# EAGLE design Multicolor LED (EAGLE 5.04)
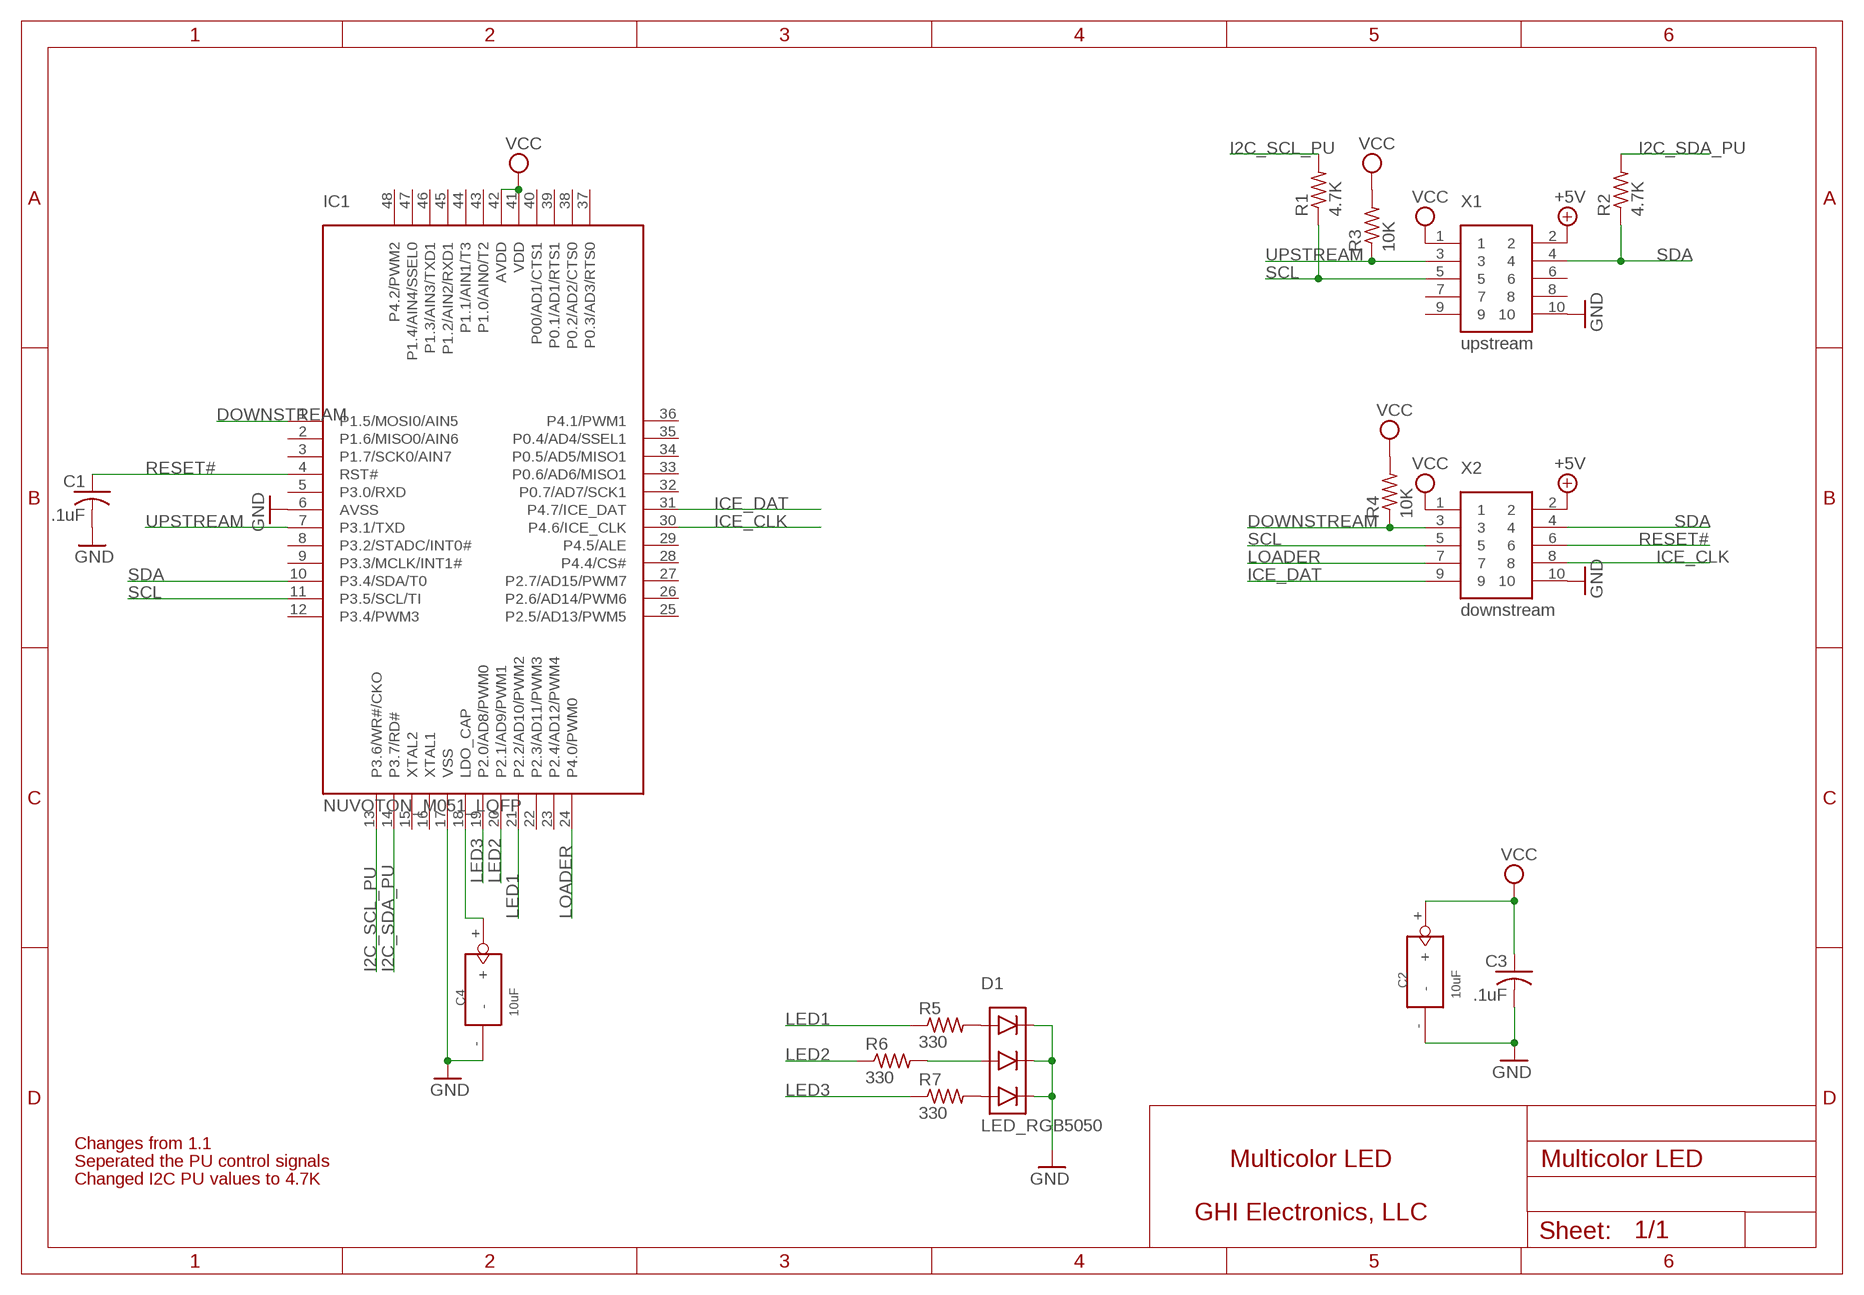
[diagram p0: schematic, sheet 1]

## Parts
C1  .1uF  C-USC0603K  [C0603K]
C2  10uF  C_TAN_3X3.5  [C_TAN_3X3.5]
C3  .1uF  C-USC0603K  [C0603K]
C4  10uF  C_TAN_3X3.5  [C_TAN_3X3.5]
D1  LED_RGB5050  [LED_RGB_5050]
IC1  NUVOTON_M051_LQFP  [LQFP48]
R1  4.7K  R-US_R0603  [R0603]
R2  4.7K  R-US_R0603  [R0603]
R3  10K  R-US_R0603  [R0603]
R4  10K  R-US_R0603  [R0603]
R5  330  R-US_R0603  [R0603]
R6  330  R-US_R0603  [R0603]
R7  330  R-US_R0603  [R0603]
X1  upstream  2X5_1.27MM  [2X5_1.27MM]
X2  downstream  2X5_1.27MM  [2X5_1.27MM]

## Nets
+5V [power]: X1.2 X2.2
DOWNSTREAM: IC1.1(P1.5/MOSI0/AIN5) R4.1 X2.3
GND [power]: C1.2 C2.- C3.2 C4.- D1.LED1K D1.LED2K D1.LED3K IC1.6(AVSS) IC1.17(VSS) X1.10 X2.10
I2C_SCL_PU: IC1.13(P3.6/WR#/CKO) R1.2
I2C_SDA_PU: IC1.14(P3.7/RD#) R2.2
ICE_CLK: IC1.30(P4.6/ICE_CLK) X2.8
ICE_DAT: IC1.31(P4.7/ICE_DAT) X2.9
LED1: IC1.21(P2.2/AD10/PWM2) R5.1
LED2: IC1.20(P2.1/AD9/PWM1) R6.1
LED3: IC1.19(P2.0/AD8/PWM0) R7.1
LOADER: IC1.24(P4.0/PWM0) X2.7
N$1: D1.LED1A R5.2
N$2: D1.LED2A R6.2
N$3: D1.LED3A R7.2
N$4: C4.+ IC1.18(LDO_CAP)
RESET#: C1.1 IC1.4(RST#) X2.6
SCL: IC1.11(P3.5/SCL/TI) R1.1 X1.5 X2.5
SDA: IC1.10(P3.4/SDA/T0) R2.1 X1.4 X2.4
UPSTREAM: IC1.7(P3.1/TXD) R3.1 X1.3
VCC [power]: C2.+ C3.1 IC1.41(VDD) IC1.42(AVDD) R3.2 R4.2 X1.1 X2.1
Unconnected: IC1.2(P1.6/MISO0/AIN6) IC1.3(P1.7/SCK0/AIN7) IC1.5(P3.0/RXD) IC1.8(P3.2/STADC/INT0#) IC1.9(P3.3/MCLK/INT1#) IC1.12(P3.4/PWM3) IC1.15(XTAL2) IC1.16(XTAL1) IC1.22(P2.3/AD11/PWM3) IC1.23(P2.4/AD12/PWM4) IC1.25(P2.5/AD13/PWM5) IC1.26(P2.6/AD14/PWM6) IC1.27(P2.7/AD15/PWM7) IC1.28(P4.4/CS#) IC1.29(P4.5/ALE) IC1.32(P0.7/AD7/SCK1) IC1.33(P0.6/AD6/MISO1) IC1.34(P0.5/AD5/MISO1) IC1.35(P0.4/AD4/SSEL1) IC1.36(P4.1/PWM1) IC1.37(P0.3/AD3/RTS0) IC1.38(P0.2/AD2/CTS0) IC1.39(P0.1/AD1/RTS1) IC1.40(P00/AD1/CTS1) IC1.43(P1.0/AIN0/T2) IC1.44(P1.1/AIN1/T3) IC1.45(P1.2/AIN2/RXD1) IC1.46(P1.3/AIN3/TXD1) IC1.47(P1.4/AIN4/SSEL0) IC1.48(P4.2/PWM2) X1.6 X1.7 X1.8 X1.9

## Notes on the sheet
- Changes from 1.1
- Seperated the PU control signals | Multicolor LED
- Changed I2C PU values to 4.7K
- GHI Electronics, LLC

## Library data of the parts
C1 C3 = rcl:C-US: CAPACITOR, American symbol
C2 C4 = CPT_SMD:C_TAN
D1 = GHI:LED_RGB
IC1 = GHI:NUVOTON_M051_LQFP
R1-R7 = rcl:R-US_: RESISTOR, American symbol
X1 X2 = GHI:2X5_1.27MM

## Net classes
0 default: width 0.254 mm, drill 0.381 mm, clearance 0.203 mm

## Board
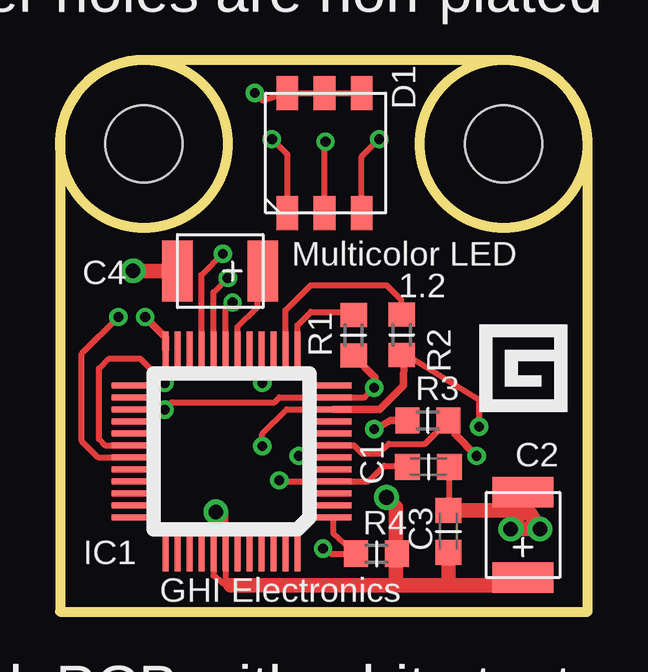
[diagram p1: board, top side]
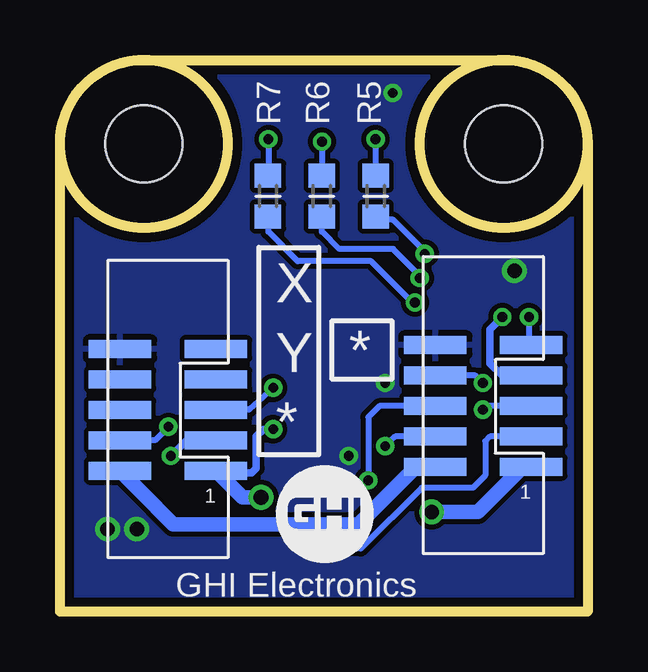
[diagram p2: board, bottom side, seen from below]

Size 22 x 23 mm. Coordinates in mm from the lower left corner, seen from the top.
Outline: 0,0 22,0 22,19.5 arc90 18.5,23 3.5,23 arc90 0,19.5 0,0
Outline: circle at 3.5,19.5 radius 3.5
Outline: circle at 18.5,19.5 radius 3.5
Copper layers (1+16): Top 0.035mm / dielectric 1.5mm / Bottom 0.035mm
Design rules "default *": minimum track width 8mil, minimum drill 12mil, track to track 8mil, track to pad 8mil, pad to pad 8mil, via to via 8mil, smd to smd 8mil, copper to edge 15mil, drill to drill 8mil, minimum pad ring 10mil, minimum via ring 7mil, stop-mask expansion 4mil, vias tented up to drill 50mil, thermal gap 10mil
Holes 3.2 mm at 18.5,19.5 3.5,19.5

### Footprints (pad centres in the part's own frame; a part is rotated, then mirrored left to right if it is on the bottom)
C0603K = smd 1.05 x 1.08: 1 -0.875,0; 2 0.875,0
C_TAN_3X3.5 = smd 2.54 x 1.27: + 0,1.778; - 0,-1.778
LED_RGB_5050 = smd 1.4 x 0.9: LED1A 2.5,-1.6; LED1K -2.5,-1.6; LED2A 2.5,-0.05; LED2K -2.5,-0.05; LED3A 2.5,1.5; LED3K -2.5,1.5
LQFP48 = smd 0.25 x 1.5: 1 -3,-4; 2 -2.5,-4; 3 -2,-4; 4 -1.5,-4; 5 -1,-4; 6 -0.5,-4; 7 0,-4; 8 0.5,-4; 9 1,-4; 10 1.5,-4; 11 2,-4; 12 2.5,-4; 25 2.5,4.5; 26 2,4.5; 27 1.5,4.5; 28 1,4.5; 29 0.5,4.5; 30 0,4.5; 31 -0.5,4.5; 32 -1,4.5; 33 -1.5,4.5; 34 -2,4.5; 35 -2.5,4.5; 36 -3,4.5 | smd 1.5 x 0.25: 13 4,-2.5; 14 4,-2; 15 4,-1.5; 16 4,-1; 17 4,-0.5; 18 4,0; 19 4,0.5; 20 4,1; 21 4,1.5; 22 4,2; 23 4,2.5; 24 4,3; 37 -4.5,3; 38 -4.5,2.5; 39 -4.5,2; 40 -4.5,1.5; 41 -4.5,1; 42 -4.5,0.5; 43 -4.5,0; 44 -4.5,-0.5; 45 -4.5,-1; 46 -4.5,-1.5; 47 -4.5,-2; 48 -4.5,-2.5
R0603 = smd 1 x 1.1: 1 -0.85,0; 2 0.85,0
2X5_1.27MM = smd 2.6 x 0.74: 1 -2,2.58; 2 2,2.58; 3 -2,1.31; 4 2,1.31; 5 -2,0.04; 6 2,0.04; 7 -2,-1.23; 8 2,-1.23; 9 -2,-2.5; 10 2,-2.5

### Placement (x,y rotation side)
C1  15.37,6.04 0 top
C2  19.31,3.19 180 top
C3  16.19,3.34 90 top
C4  6.68,14.19 270 top
D1  11.08,19.11 270 top
IC1  7.4,6.93 90 top
R1  12.24,11.52 90 top
R2  14.25,11.54 90 top
R3  15.35,7.97 180 top
R4  13.2,2.41 0 top
R5  8.83,17.32 90 bottom
R6  11.08,17.32 90 bottom
R7  13.33,17.32 90 bottom
X1  17.49,8.45 180 bottom
X2  4.35,8.61 180 bottom

### Tracks (layer width: path | path; a pad name or v marks a point on that pad's centre or on a via)
+5V
  Bottom 0.61: X2.2 7.16,6.03 9.55,3.64 17.27,3.64 17.98,4.35 X1.2
DOWNSTREAM  (via drill 0.41)
  Top 0.254: v10.97,2.63 11.29,2.41 R4.1 11.4,3.26 IC1.1
  Bottom 0.254: X2.3 4.06,7.3 4.27,7.1 4.27,5.67 4.78,5.17 6.91,5.17 9.45,2.63 v10.97,2.63
GND  (via drill 0.41, 0.61)
  Top 0.254: D1.LED3K D1.LED2K D1.LED1K 8.44,21.31 v8.13,21.62 | IC1.17 7.9,10.06 v8.43,9.53 | C1.2 16.24,4.27 C3.2 | IC1.6 10.02,6.43 v9.96,6.49
  Top 0.61: C4.- 3.06,14.2 v3.05,14.21 | C3.2 18.66,4.22 19.2,4.08 v18.8,3.44 v20.02,3.44 19.31,4.55 C2.-
  pour Bottom: 22.05,-0.1 22.05,19.65 arc90 18.55,23.15 3.5,23.15 arc90 0,19.65 0,-0.1
I2C_SCL_PU
  Top 0.254: IC1.13 9.9,11.94 10.46,12.5 12.12,12.5 R1.2
I2C_SDA_PU
  Top 0.254: IC1.14 9.4,12.55 10.46,13.61 13.61,13.61 14.22,13.01 14.22,12.41 R2.2
ICE_CLK  (via drill 0.41)
  Top 0.254: IC1.30 1.9,6.93 1.63,7.2 1.63,10.14 2.03,10.55 3.35,10.55 v4.37,9.53
  Bottom 0.254: v4.37,9.53 4.67,9.84 X2.8
ICE_DAT  (via drill 0.41)
  Top 0.254: IC1.31 1.58,6.43 0.91,7.1 0.91,10.75 v2.44,12.28
  Bottom 0.254: v2.44,12.28 2.44,11.2 X2.9
LED1  (via drill 0.41)
  Top 0.254: IC1.21 5.9,14.03 v6.79,14.92
  Bottom 0.254: v6.79,14.92 6.81,15.04 8.11,16.34 8.7,16.34 R5.1
LED2  (via drill 0.41)
  Top 0.254: IC1.20 6.4,13.31 v6.99,13.9
  Bottom 0.254: v6.99,13.9 7.1,13.9 7.01,14.02 8.11,15.12 10.36,15.12 11.07,15.83 R6.1
LED3  (via drill 0.41)
  Top 0.254: IC1.19 6.9,12.59 v7.2,12.89
  Bottom 0.254: v7.2,12.89 7.32,12.9 9.03,14.61 12.09,14.61 13.31,15.83 13.31,16.45 R7.1
LOADER  (via drill 0.41)
  Top 0.305: IC1.24 4.4,11.43 v3.56,12.28
  Bottom 0.305: X2.7 3.56,9.84 4.06,10.35 4.06,11.77 v3.56,12.28
N$1  (via drill 0.41)
  Top 0.254: D1.LED1A 9.48,19.05 v8.84,19.69
  Bottom 0.254: v8.84,19.69 R5.2
N$2  (via drill 0.41)
  Top 0.254: D1.LED2A 11.03,19.55 v11.07,19.59
  Bottom 0.254: v11.07,19.59 R6.2
N$3  (via drill 0.41)
  Top 0.254: D1.LED3A 12.58,18.96 v13.31,19.69
  Bottom 0.254: v13.31,19.69 13.31,18.19 R7.2
N$4
  Top 0.254: IC1.18 7.4,11.86 8.23,12.68 8.23,14.06 C4.+
RESET#  (via drill 0.41)
  Top 0.254: C1.1 14.23,6.08 13.51,6.08 12.86,5.43 IC1.4 9.19,5.43 v9.14,5.47
  Bottom 0.254: X2.6 8.69,8.57 9.14,8.11 v9.14,5.47
SCL  (via drill 0.41)
  Top 0.254: v4.37,8.42 4.67,8.72 8.94,8.72 9.15,8.93 IC1.11 12.7,8.93 v13.11,9.33 13.11,9.43
  Top 0.305: R1.1 13.13,9.76 v13.11,9.33
  Bottom 0.254: X2.5 4.32,8.57 v4.37,8.42 | v13.11,9.33 14.12,8.42 X1.5
SDA  (via drill 0.41)
  Top 0.254: IC1.10 9.46,8.43 8.43,7.4 v8.43,6.89 | v17.48,7.71 17.48,8.01 17.46,8.83 14.53,10.66 14.36,10.53 R2.1
  Top 0.305: IC1.10 13.32,8.43 14.33,9.43 14.34,10.55 14.36,10.53
  Bottom 0.254: X2.4 8.03,7.3 v8.43,6.89 | X1.4 18.04,7.14 v17.48,7.71
UPSTREAM  (via drill 0.41)
  Top 0.254: IC1.7 12.26,6.93 12.6,6.59 13.31,6.59 13.72,6.99 15.22,6.99 R3.1
  Top 0.305: v17.37,6.49 16.46,7.4 16.46,7.71 R3.1
  Bottom 0.305: X1.3 16.72,7.14 v17.37,6.49
VCC  (via drill 0.41, 0.61)
  Top 0.254: 7.11,1.1 6.9,1.31 IC1.42 6.9,4.05 v6.5,4.15 6.4,4.36 IC1.41 6.4,1.51 7,1
  Top 0.305: R3.2 13.78,7.97 v13.11,7.6
  Top 0.61: v6.5,4.15 6.5,3.74 | 7.11,1.1 14.12,1.1 | 14.12,1.1 16.15,1.1 | 16.15,1.1 19,1.1 C2.+ | v13.61,4.76 14.02,4.35 14.02,2.69 | 14.02,2.69 R4.2 | 14.02,2.69 14.02,1.2 14.12,1.1 | C3.1 16.19,1.14 16.15,1.1
  Bottom 0.305: v13.11,7.6 13.51,7.6 13.82,7.3 13.82,5.98 14.02,5.78 14.63,5.78 15.02,5.39
  Bottom 0.61: X2.1 2.69,6.03 4.57,4.15 v6.5,4.15 | v13.61,4.76 14.38,4.76 15.02,5.39 X1.1

### Text on the board
tPlace: corner holes are non-plated | Multicolor LED | 1.2 | GHI Electronics | Black PCB with white text | do not add manufacturing codes
bPlace: X | * | Y | * | GHI Electronics